# EAGLE design Freaq (EAGLE 9.6.2)
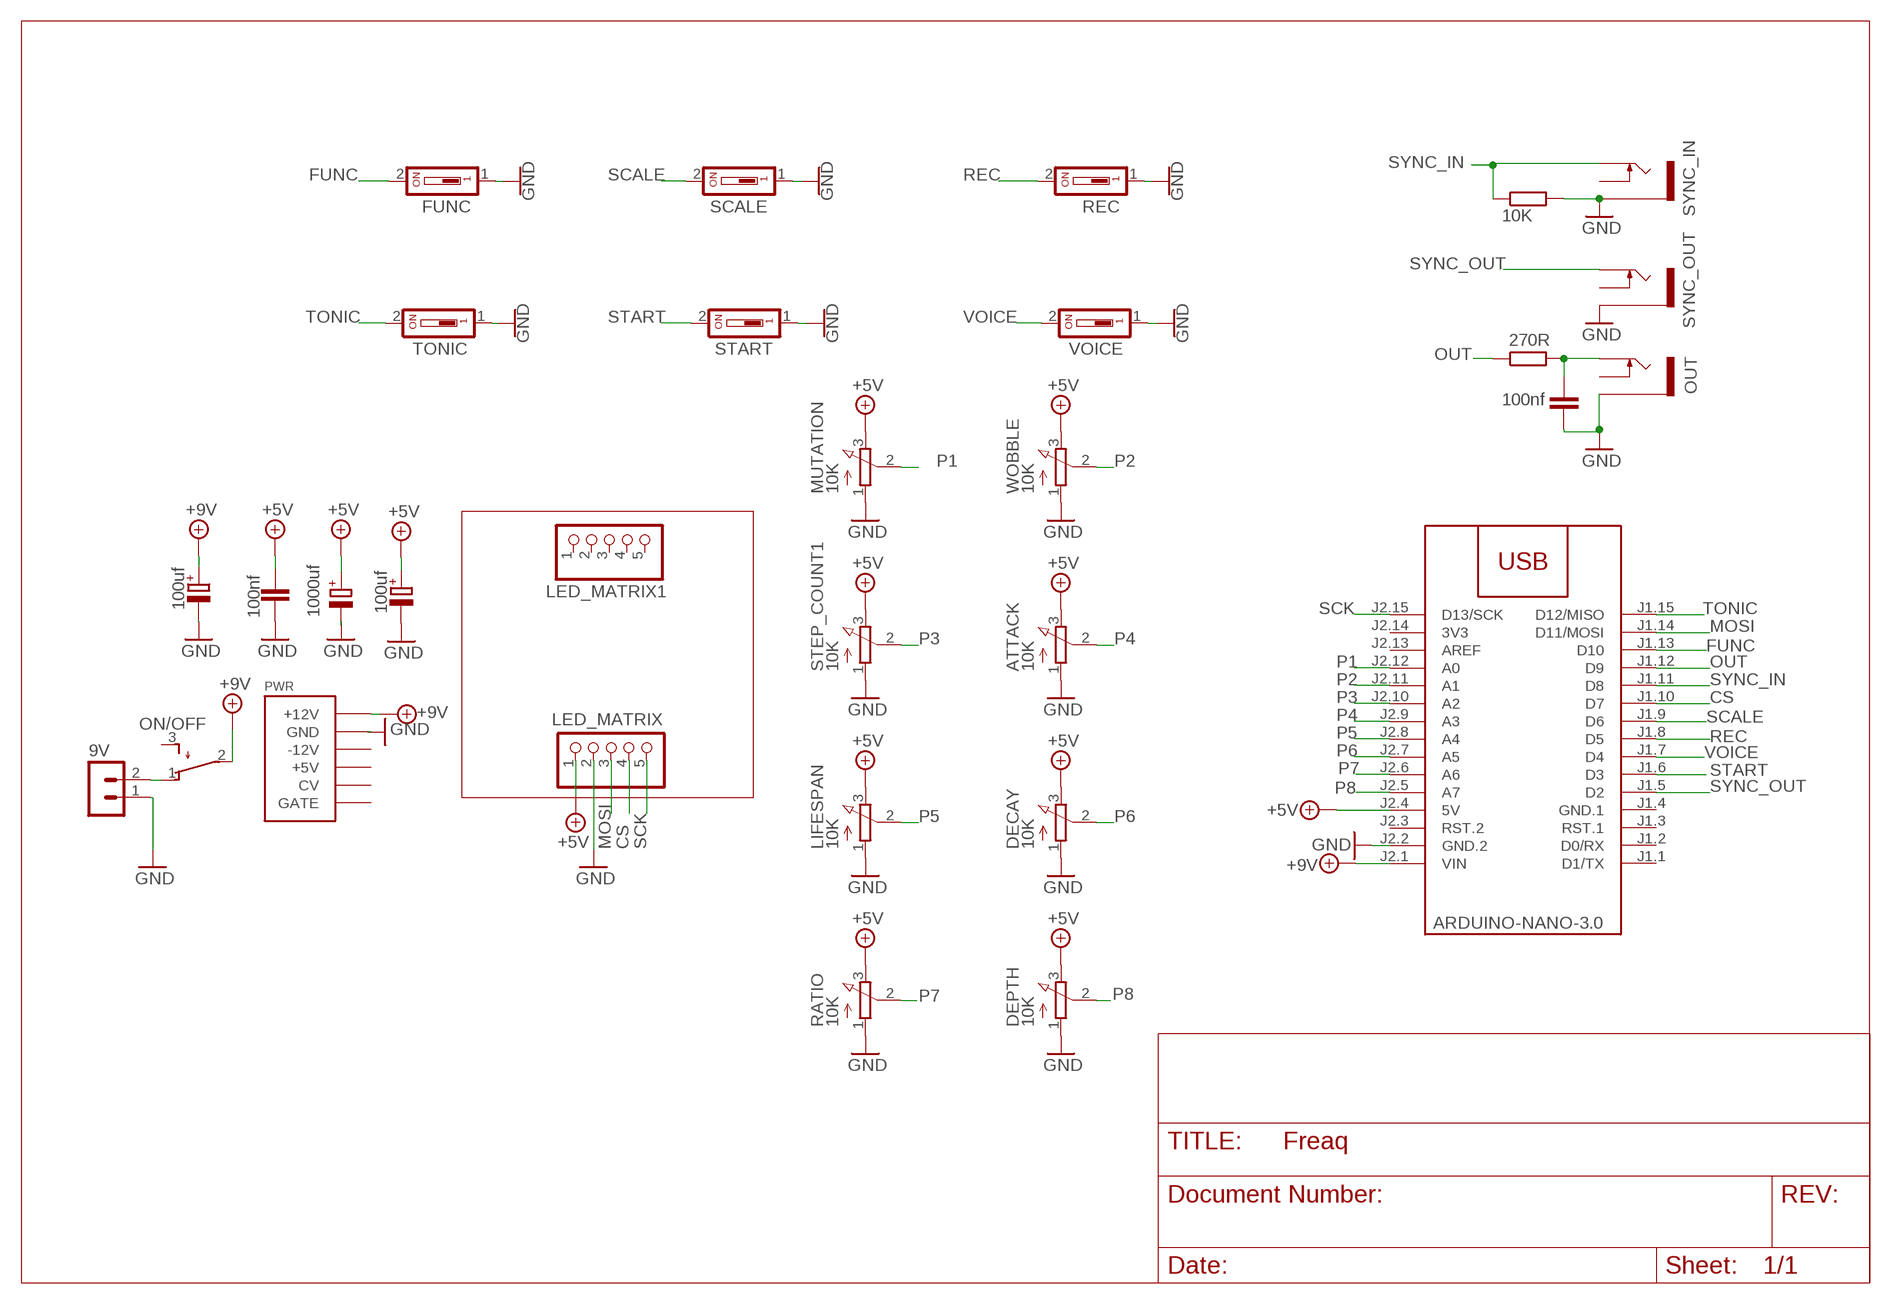
[diagram p0: schematic, sheet 1]

## Parts
9V  B2B-PH-K-S  [B2B-PH-K-S]
ATTACK  10K  EVUF2L  [EVUFXL]
C1  100nf  C-EU050-024X044  [C050-024X044]
C2  100uf  CPOL-EUE2-5  [E2-5]
C3  100uf  CPOL-EUE2-5  [E2-5]
C4  100nf  C-EU050-024X044  [C050-024X044]
C5  1000uf  CPOL-EUE2,5-6E  [E2,5-6E]
DECAY  10K  EVUF2L  [EVUFXL]
DEPTH  10K  EVUF2L  [EVUFXL]
FUNC  DS01  [DS-01]
LED_MATRIX  PINHD-1X5  [1X05]
LED_MATRIX1  PINHD-1X5  [1X05]
LIFESPAN  10K  EVUF2L  [EVUFXL]
M1  ARDUINO-NANO-3.0  [ARDUINO-NANO-3.0]
MUTATION  10K  EVUF2L  [EVUFXL]
ON/OFF  TL32PO  [TL3XPO]
OUT  THONKICONNNEW  [WQP-PJ301M-12_JACK]
PWR  POWER  [POWER_16]
R7  10K  R-EU_0207/10  [0207/10]
R8  270R  R-EU_0207/10  [0207/10]
RATIO  10K  EVUF2L  [EVUFXL]
REC  DS01  [DS-01]
SCALE  DS01  [DS-01]
START  DS01  [DS-01]
STEP_COUNT1  10K  EVUF2L  [EVUFXL]
SYNC_IN  THONKICONNNEW  [WQP-PJ301M-12_JACK]
SYNC_OUT  THONKICONNNEW  [WQP-PJ301M-12_JACK]
TONIC  DS01  [DS-01]
VOICE  DS01  [DS-01]
WOBBLE  10K  EVUF2L  [EVUFXL]

## Nets
+5V: ATTACK.3(E) C1.1 C2.+ C5.+ DECAY.3(E) DEPTH.3(E) LED_MATRIX.1 LIFESPAN.3(E) M1.J2.4(5V) MUTATION.3(E) RATIO.3(E) STEP_COUNT1.3(E) WOBBLE.3(E)
+9V: C3.+ M1.J2.1(VIN) ON/OFF.2(P) PWR.9(+12V) PWR.10(+12V)
CS: LED_MATRIX.4 M1.J1.10(D7)
FUNC: FUNC.2 M1.J1.13(D10)
GND: 9V.1 ATTACK.1(A) C1.2 C2.- C3.- C4.2 C5.- DECAY.1(A) DEPTH.1(A) FUNC.1 LED_MATRIX.2 LIFESPAN.1(A) M1.J2.2(GND.2) MUTATION.1(A) OUT.P$3_SLEEVE(SLEEVE) PWR.3(GND) PWR.4(GND) PWR.5(GND) PWR.6(GND) PWR.7(GND) PWR.8(GND) R7.2 RATIO.1(A) REC.1 SCALE.1 START.1 STEP_COUNT1.1(A) SYNC_IN.P$3_SLEEVE(SLEEVE) SYNC_OUT.P$3_SLEEVE(SLEEVE) TONIC.1 VOICE.1 WOBBLE.1(A)
MOSI: LED_MATRIX.3 M1.J1.14(D11/MOSI)
N$2: 9V.2 ON/OFF.1(O)
N$4: C4.1 OUT.P$1_TIP(TIP) R8.2
OUT: M1.J1.12(D9) R8.1
P1: M1.J2.12(A0) MUTATION.2(S)
P2: M1.J2.11(A1) WOBBLE.2(S)
P3: M1.J2.10(A2) STEP_COUNT1.2(S)
P4: ATTACK.2(S) M1.J2.9(A3)
P5: LIFESPAN.2(S) M1.J2.8(A4)
P6: DECAY.2(S) M1.J2.7(A5)
P7: M1.J2.6(A6) RATIO.2(S)
P8: DEPTH.2(S) M1.J2.5(A7)
REC: M1.J1.8(D5) REC.2
SCALE: M1.J1.9(D6) SCALE.2
SCK: LED_MATRIX.5 M1.J2.15(D13/SCK)
START: M1.J1.6(D3) START.2
SYNC_IN: M1.J1.11(D8) R7.1 SYNC_IN.P$1_TIP(TIP)
SYNC_OUT: M1.J1.5(D2) SYNC_OUT.P$1_TIP(TIP)
TONIC: M1.J1.15(D12/MISO) TONIC.2
VOICE: M1.J1.7(D4) VOICE.2
Unconnected: LED_MATRIX1.1 LED_MATRIX1.2 LED_MATRIX1.3 LED_MATRIX1.4 LED_MATRIX1.5 M1.J1.1(D1/TX) M1.J1.2(D0/RX) M1.J1.3(RST.1) M1.J2.3(RST.2) M1.J2.13(AREF) ON/OFF.3(S) OUT.P$2_SWITCH(SWITCH) PWR.1(-12V) PWR.2(-12V) PWR.11(+5V) PWR.12(+5V) PWR.13(CV) PWR.14(CV) PWR.15(GATE) PWR.16(GATE) SYNC_IN.P$2_SWITCH(SWITCH) SYNC_OUT.P$2_SWITCH(SWITCH)

## Power pins joined to a net without a drawn wire
3V3: M1.J2.14(3V3)
GND.1: M1.J1.4(GND.1)

## Library data of the parts
9V = con-JST PH:B2B-PH: JST PH series header 2.00mm pitch disconnectable crimp style connectors, vertical (side entry type), 2 pins
ATTACK DECAY DEPTH LIFESPAN MUTATION RATIO STEP_COUNT1 WOBBLE = pot:EVU: 9 mm Square Rotary Potentiometers Source: Panasonic
C1 C4 = rcl:C-EU: CAPACITOR, European symbol; SPICEPREFIX: C
C2 C3 C5 = rcl:CPOL-EU: POLARIZED CAPACITOR, European symbol; SPICEPREFIX: C
FUNC REC SCALE START TONIC VOICE = 5mm SPST Switch:DS01: DIL/CODE SWITCH; OC_FARNELL: unknown; OC_NEWARK: unknown
LED_MATRIX LED_MATRIX1 = pinhead:PINHD-1X5: PIN HEADER
M1 = diy-modules:ARDUINO-NANO-3.0: Arduino Nano 3.0 and compatible devices More details available here: https://www.arduino.cc/en/Main/ArduinoBoardNano Click here to find device on ebay.com <http://www.ebay.com/sch/arduino+nano>
ON/OFF = switch:TL32PO: TINY SWITCH ON - MOM Source: http://www2.produktinfo.conrad.com/datenblaetter/700000-724999/705152-da-01-de-Subminiaturschalter_TL_36YO.pdf
OUT SYNC_IN SYNC_OUT = MusicThingModular:THONKICONN: 3.5mm socket for Eurorack modular synths
PWR = EurorackModularParts:POWER
R7 R8 = rcl:R-EU_: RESISTOR, European symbol; SPICEPREFIX: R

## Board
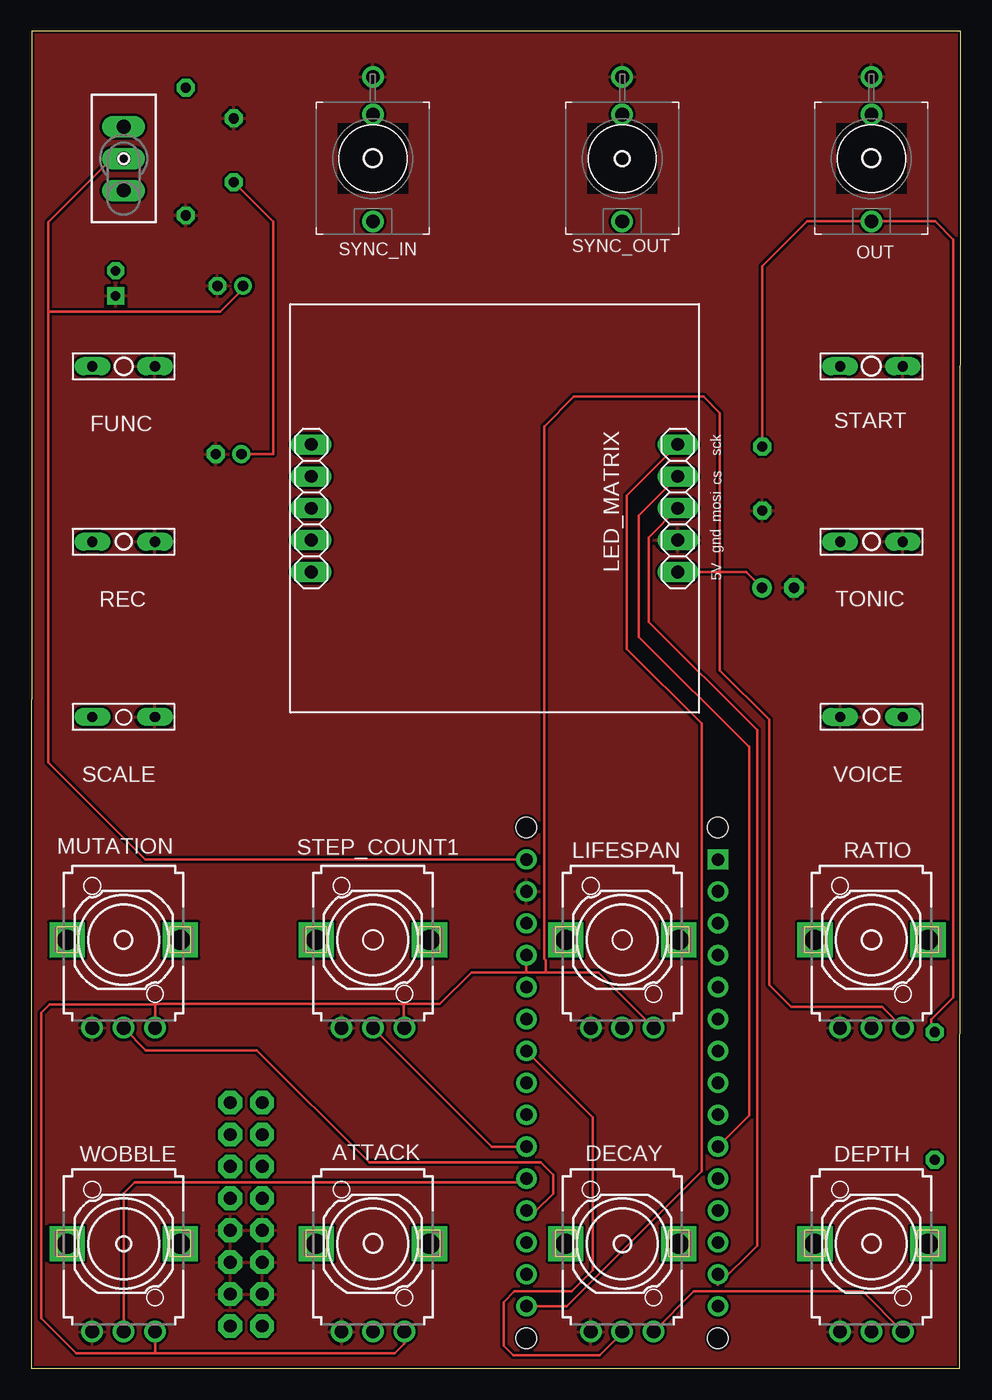
[diagram p1: board, top side]
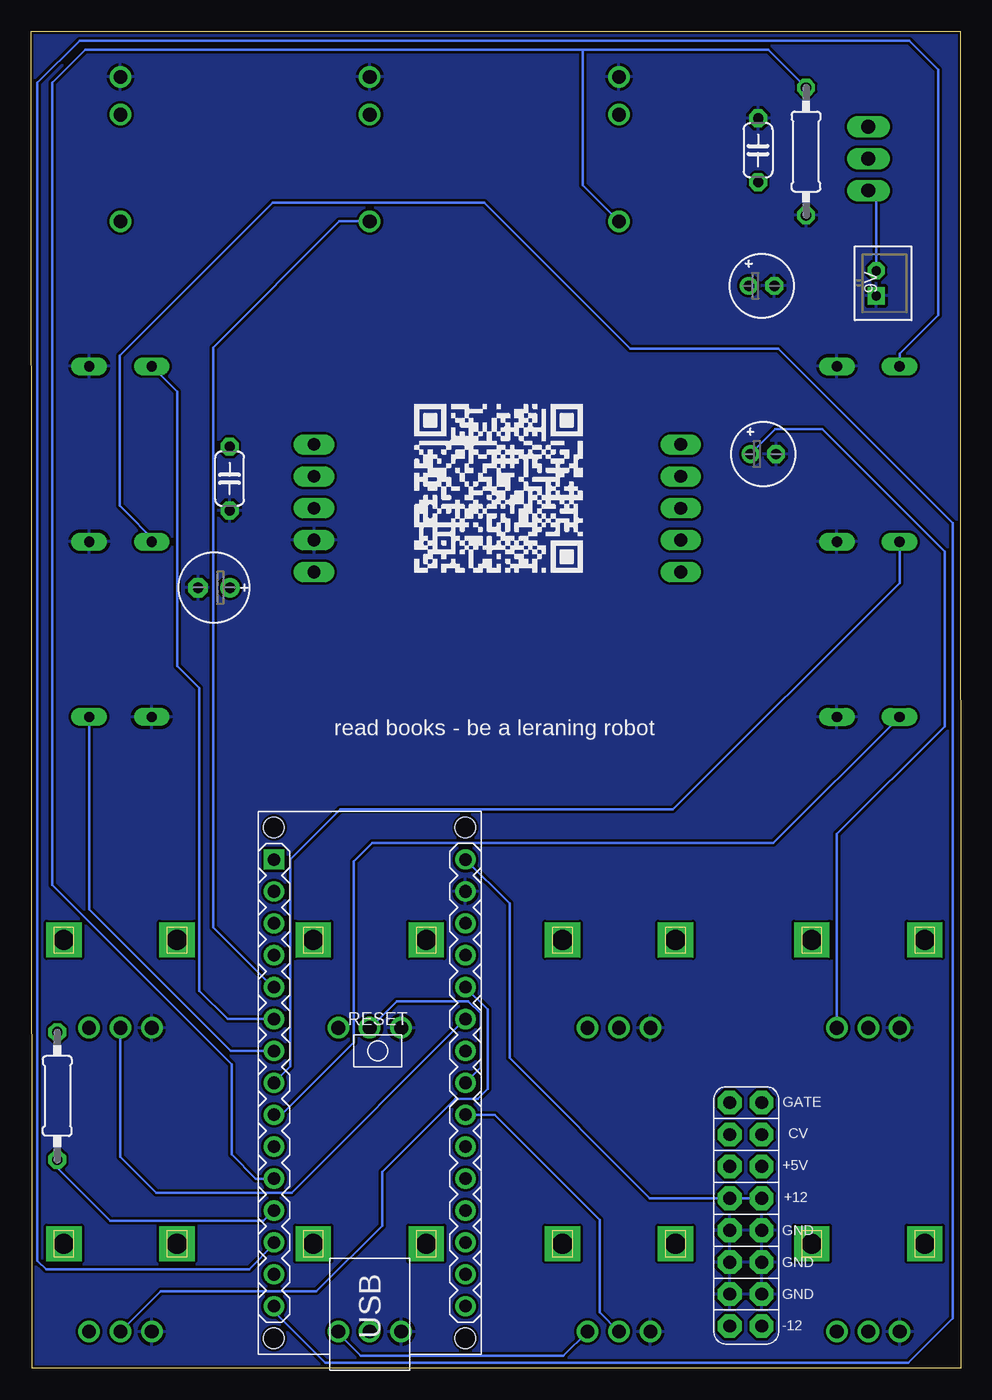
[diagram p2: board, bottom side, seen from below]

Size 73.94 x 106.42 mm. Coordinates in mm from the lower left corner, seen from the top.
Outline: 0,0 73.89,0 73.94,106.42 0.03,106.42 0,0
Copper layers (1*16): Top 0.035mm / dielectric 1.5mm / Bottom 0.035mm
Design rules "SparkFun": minimum track width 8mil, minimum drill 20mil, track to track 8mil, track to pad 8mil, pad to pad 8mil, via to via 8mil, smd to smd 8mil, copper to edge 8mil, drill to drill 8mil, minimum pad ring 12mil, minimum via ring 10mil, stop-mask expansion 4mil, vias tented up to drill 20mil, thermal gap 10mil

### Footprints (pad centres in the part's own frame; a part is rotated, then mirrored left to right if it is on the bottom)
B2B-PH-K-S = drill 0.75 pad 1.3 square: 1 1,0 | drill 0.75 pad 1.3 octagon: 2 -1,0
EVUFXL = drill 1.1 pad 1.676: 1 -2.5,-7; 2 0,-7; 3 2.5,-7 | drill 1.6 pad 2.8 square: M1 4.5,0; M2 -4.5,0
C050-024X044 = drill 0.813 octagon: 1 -2.54,0; 2 2.54,0
E2-5 = drill 0.813 pad 1.27: + -1.016,0 | drill 0.813 pad 1.27 octagon: - 1.016,0
E2,5-6E = drill 0.813 pad 1.575: + -1.27,0 | drill 0.813 pad 1.575 octagon: - 1.27,0
DS-01 = drill 0.813 long: 1 2.489,0; 2 -2.489,0
1X05 = drill 1.016 long: 1 -5.08,0; 2 -2.54,0; 3 0,0; 4 2.54,0; 5 5.08,0
ARDUINO-NANO-3.0 = drill 1 square: J1.1 17.78,7.62 | drill 1: J1.2 15.24,7.62; J1.3 12.7,7.62; J1.4 10.16,7.62; J1.5 7.62,7.62; J1.6 5.08,7.62; J1.7 2.54,7.62; J1.8 0,7.62; J1.9 -2.54,7.62; J1.10 -5.08,7.62; J1.11 -7.62,7.62; J1.12 -10.16,7.62; J1.13 -12.7,7.62; J1.14 -15.24,7.62; J1.15 -17.78,7.62; J2.1 17.78,-7.62; J2.2 15.24,-7.62; J2.3 12.7,-7.62; J2.4 10.16,-7.62; J2.5 7.62,-7.62; J2.6 5.08,-7.62; J2.7 2.54,-7.62; J2.8 0,-7.62; J2.9 -2.54,-7.62; J2.10 -5.08,-7.62; J2.11 -7.62,-7.62; J2.12 -10.16,-7.62; J2.13 -12.7,-7.62; J2.14 -15.24,-7.62; J2.15 -17.78,-7.62 | hole 1.651: -20.32,7.62; -20.32,-7.62; 20.32,-7.62; 20.32,7.62
TL3XPO = drill 1.1 pad 1.422 long: 1 -2.54,0; 2 0,0; 3 2.54,0
WQP-PJ301M-12_JACK = drill 1.1: P$1_TIP 0,5; P$2_SWITCH 0,-3.5; P$3_SLEEVE 0,-6.5
POWER_16 = drill 1.016 pad 1.88 octagon: 1 -8.89,-1.27; 2 -8.89,1.27; 3 -6.35,-1.27; 4 -6.35,1.27; 5 -3.81,-1.27; 6 -3.81,1.27; 7 -1.27,-1.27; 8 -1.27,1.27; 9 1.27,-1.27; 10 1.27,1.27; 11 3.81,-1.27; 12 3.81,1.27; 13 6.35,-1.27; 14 6.35,1.27; 15 8.89,-1.27; 16 8.89,1.27
0207/10 = drill 0.813 octagon: 1 -5.08,0; 2 5.08,0

### Placement (x,y rotation side)
9V  6.71,86.36 270 bottom
ATTACK  27.18,9.91 0 top
C1  16.1,96.95 90 bottom
C2  15.7,72.77 0 bottom
C3  15.82,86.16 0 bottom
C4  58.17,70.82 270 bottom
C5  59.41,62.13 180 bottom
DECAY  47.02,9.91 0 top
DEPTH  66.85,9.91 0 top
FUNC  7.34,79.76 0 top
LED_MATRIX  51.45,68.45 90 top
LED_MATRIX1  22.26,68.45 90 top
LIFESPAN  47.02,34.09 0 top
M1  47.02,22.71 90 bottom
MUTATION  7.34,34.09 0 top
ON/OFF  7.34,96.29 90 top
OUT  66.85,96.29 180 top
PWR  17.09,12.24 90 bottom
R7  12.29,96.85 270 bottom
R8  71.88,21.67 90 bottom
RATIO  66.85,34.09 0 top
REC  7.34,65.79 0 top
SCALE  7.34,51.84 0 top
START  66.85,79.76 0 top
STEP_COUNT1  27.18,34.09 0 top
SYNC_IN  27.18,96.29 180 top
SYNC_OUT  47.02,96.29 180 top
TONIC  66.85,65.79 0 top
VOICE  66.85,51.84 180 top
WOBBLE  7.34,9.91 0 top

### Tracks (layer width: path | path; a pad name or v marks a point on that pad's centre or on a via)
+5V
  Top 0.203: DECAY.3 52.71,6.1 66.16,6.1 DEPTH.3 | 29.64,28.98 32.51,28.98 35.03,31.5 39.42,31.5 | 29.64,28.98 9.91,28.98 9.88,28.96 | 9.88,28.96 1.45,28.96 0.77,28.28 0.77,3.97 3.56,1.19 9.84,1.19 | STEP_COUNT1.3 29.64,27.12 29.64,28.98 | MUTATION.3 9.84,28.92 9.88,28.96 | ATTACK.3 29.68,1.94 28.93,1.19 9.84,1.19 | RATIO.3 67.7,28.74 60.46,28.74 58.7,30.5 58.7,51.63 54.79,55.54 54.79,63.3 | LIFESPAN.3 45.11,31.5 40.92,31.5 | 40.92,31.5 39.42,31.5 | WOBBLE.3 9.84,1.19 | C1.1 19.25,91.26 19.25,72.77 C2.+ | M1.J2.4 39.4,31.52 39.42,31.5 | 40.92,31.5 40.92,32.45 40.81,32.56 40.81,74.97 43.18,77.34 53.49,77.34 54.79,76.05 54.79,63.3 | LED_MATRIX.1 54.43,63.37 54.71,63.37 | 54.71,63.37 54.79,63.3 | C5.+ 56.9,63.37 54.71,63.37
  Bottom 0.203: MUTATION.3 9.84,42.51 1.27,51.08 1.27,65.02 11,74.75 14.73,74.75 C2.+ | DECAY.3 49.52,2.75 47.73,0.96 31.62,0.96 ATTACK.3
+9V
  Top 0.203: ON/OFF.2 6.4,96.29 1.33,91.22 1.33,84.12 | 1.33,84.12 1.33,48.22 9.07,40.49 M1.J2.1 | 1.33,84.12 15.01,84.12 16.84,85.95 C3.+
  Bottom 0.203: PWR.9 PWR.10 24.71,13.51 35.89,24.69 35.89,36.98 M1.J2.1
CS
  Top 0.203: M1.J1.10 57.14,20.13 57.14,49.48 57.07,49.48 48.34,58.22 48.34,67.88 LED_MATRIX.4
FUNC
  Bottom 0.203: M1.J1.13 54.64,9.85 56.62,7.87 72.77,7.87 73.46,8.56 73.46,102.31 70.1,105.66 4.06,105.66 1.78,103.38 1.78,83.85 4.85,80.77 FUNC.2
GND
  pour Top: 0.08,0.05 73.99,0.05 73.99,106.48 0.08,106.48
  pour Bottom: 0.08,0.05 73.99,0.05 73.99,106.48 0.08,106.48
MOSI
  Top 0.203: M1.J1.14 54.64,6.62 57.75,9.73 57.75,50.79 49.12,59.41 49.12,66.13 LED_MATRIX.3
N$2
  Bottom 0.203: 9V.2 6.71,93.12 ON/OFF.1
N$4
  Top 0.203: R8.2 71.63,27 71.63,27.76 73.38,29.51 73.38,89.84 71.93,91.29 OUT.P$1_TIP 61.73,91.29 58.17,87.73 C4.1
OUT
  Bottom 0.203: M1.J1.12 55.47,11.71 67.67,11.71 71.88,15.93 R8.1
P1
  Top 0.203: M1.J2.12 40.18,12.55 41.53,13.89 41.53,15.39 40.54,16.38 26.87,16.38 17.95,25.31 9.12,25.31 MUTATION.2
P2
  Top 0.203: M1.J2.11 39.12,14.81 8.23,14.81 7.34,13.92 WOBBLE.2
P3
  Top 0.203: M1.J2.10 36.64,17.63 STEP_COUNT1.2
P4
  Bottom 0.203: M1.J2.9 37.07,20.17 28.7,11.8 28.7,4.43 ATTACK.2
P5
  Bottom 0.203: M1.J2.8 38.18,23.93 38.18,28.22 39.17,29.21 44.86,29.21 46.98,27.09 LIFESPAN.2
P6
  Top 0.203: M1.J2.7 44.68,19.96 44.68,7.77 43,6.1 38.43,6.1 37.59,5.26 37.59,1.78 38.35,1.02 45.21,1.02 47.02,2.82 DECAY.2
P7
  Bottom 0.203: M1.J2.6 53.21,13.97 64.01,13.97 66.85,16.81 RATIO.2
P8
  Bottom 0.203: DEPTH.2 63.66,6.1 51.25,6.1 46.03,11.33 46.03,15.62 40.21,21.44 38.43,21.44 37.64,22.22 37.64,28.57 M1.J2.5
REC
  Bottom 0.203: REC.2 4.85,62.51 22.89,44.48 49.38,44.48 53.34,40.51 53.34,24 M1.J1.8
SCALE
  Bottom 0.203: M1.J1.9 54.05,20.17 48.29,25.93 48.29,40.32 46.81,41.8 14.9,41.8 SCALE.2
SCK
  Top 0.203: M1.J2.15 42.6,4.93 53.34,15.67 53.34,51.31 47.4,57.25 47.4,69.48 LED_MATRIX.5
START
  Bottom 0.203: M1.J1.6 58.32,27.79 60.58,30.05 60.58,54.13 62.33,55.88 62.33,77.72 START.2
SYNC_IN
  Bottom 0.203: 30.07,104.95 69.67,104.95 72.29,102.34 72.29,38.47 58.01,24.19 58.01,17.02 56.08,15.09 M1.J1.11 | R7.1 15.32,104.95 30.07,104.95 | SYNC_IN.P$1_TIP 30.07,94.19 30.07,104.95
SYNC_OUT
  Bottom 0.203: SYNC_OUT.P$1_TIP 49.43,91.29 59.46,81.26 59.46,35.08 54.71,30.33 M1.J1.5
TONIC
  Bottom 0.203: M1.J1.15 54.64,4.52 50.55,0.43 4.14,0.43 0.61,3.96 0.61,67.26 14.5,81.15 26.26,81.15 37.9,92.79 54.74,92.79 66.93,80.61 66.93,68.66 63.86,65.58 64.16,65.58 TONIC.2
VOICE
  Bottom 0.203: M1.J1.7 58.06,25.25 69.34,36.52 VOICE.2

### Text on the board
tPlace: sck | cs | mosi | gnd | 5V
bPlace: read books - be a leraning robot